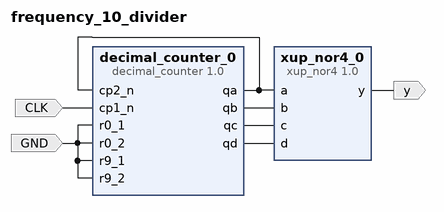
[diagram p0: block diagram of the top level]
# Vivado block design frequency_10_divider, xc7a35tcpg236-1, Vivado 2021.1
create_bd_design frequency_10_divider

create_bd_port -dir I CLK
create_bd_port -dir I GND
create_bd_port -dir O y

create_bd_cell -type ip -vlnv xilinx.com:XUP:decimal_counter:1.0 decimal_counter_0
create_bd_cell -type ip -vlnv xilinx.com:xup:xup_nor4:1.0 xup_nor4_0

# ---- connections ----

connect_bd_net [get_bd_ports CLK] [get_bd_pins decimal_counter_0/cp1_n]
connect_bd_net [get_bd_ports GND] \
  [get_bd_pins decimal_counter_0/r9_2] [get_bd_pins decimal_counter_0/r0_1] [get_bd_pins decimal_counter_0/r0_2] \
  [get_bd_pins decimal_counter_0/r9_1]
connect_bd_net [get_bd_pins decimal_counter_0/qa] [get_bd_pins decimal_counter_0/cp2_n] [get_bd_pins xup_nor4_0/a]
connect_bd_net [get_bd_pins decimal_counter_0/qb] [get_bd_pins xup_nor4_0/b]
connect_bd_net [get_bd_pins decimal_counter_0/qc] [get_bd_pins xup_nor4_0/c]
connect_bd_net [get_bd_pins decimal_counter_0/qd] [get_bd_pins xup_nor4_0/d]
connect_bd_net [get_bd_pins xup_nor4_0/y] [get_bd_ports y]

validate_bd_design
save_bd_design
